# Altium project LMD18200直流电机驱动器.PrjPCB
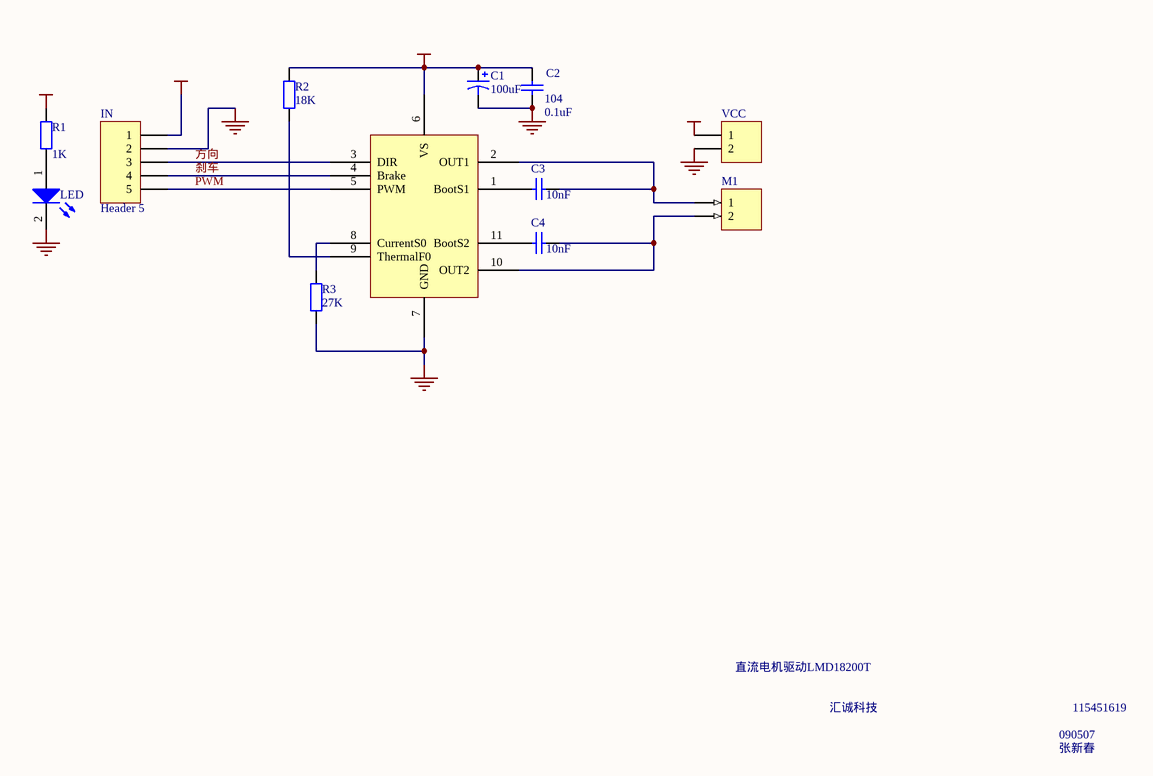
[diagram p0: LMD18200直流电机驱动器.SchDoc]
1 sheet, 12 parts. Net scope: global (net labels, ports and power ports of the same name join across sheets).
Board file: LMD18200直流电机驱动器.PcbDoc

## Sheet LMD18200直流电机驱动器.SchDoc
size A4

### Parts
C1  value 100uF  [C-DJ-6]
C2  104  value 0.1uF  [CPDR]
C3  value 10nF  [CPDR]  (hidden comment: 104)
C4  value 10nF  [CPDR]  (hidden comment: 104)
DS1  LED  [LED_D]
IN  Header 5  [HDR1X5]
M1  (no value)  [JK128_2]
R1  value 1K  [RSE]  (hidden comment: Res)
R2  value 18K  [RSE]
R3  value 27K  [RSE]
VCC  (no value)  [JK128_2]
  (no value)  [LMD18200]

### Nets
+5V: IN.1 R1.2
GND: C1.2 C2.1 DS1.2(K) IN.2 R3.1 VCC.2 .7(GND)
VCC: C1.1 C2.2 R2.2 VCC.1 .6(VS)
PWM: IN.5 .5(PWM)
刹车: IN.4 .4(Brake)
方向: IN.3 .3(DIR)
NetC3_1: C3.1 M1.1 .2(OUT1)
NetC3_2: C3.2 .1(BootS1)
NetC4_1: C4.1 M1.2 .10(OUT2)
NetC4_2: C4.2 .11(BootS2)
NetDS1_1: DS1.1(A) R1.1
NetR2_1: R2.1 .9(ThermalF0)
NetR3_2: R3.2 .8(CurrentS0)

### Notes on the sheet
- 直流电机驱动LMD18200T
- 汇诚科技
- 090507
- 115451619
- 张新春

### Library data of the parts
C1 = Cap Pol3: Polarized Capacitor (Surface Mount); Published: 8-Jun-2000; LatestRevisionDate: 17-Jul-2002; LatestRevisionNote: Re-released for DXP Platform.; PackageReference: C0805; Publisher: Altium Limited
C2-C4 = Cap: Capacitor; Published: 8-Jun-2000; LatestRevisionDate: 17-Jul-2002; LatestRevisionNote: Re-released for DXP Platform.; Publisher: Altium Limited
DS1 = LED: 发光二极管; Published: 8-Jun-2000; LatestRevisionDate: 17-Jul-2002; LatestRevisionNote: Re-released for DXP Platform.; Publisher: Altium Limited
IN = Header 5: Header, 5-Pin; LatestRevisionDate: 17-Jul-2002; LatestRevisionNote: Re-released for DXP Platform.; Publisher: Altium Limited
M1 VCC = MHDR1X2: Header, 2-Pin; LatestRevisionDate: 17-Jul-2002; LatestRevisionNote: Re-released for DXP Platform.; Publisher: Altium Limited
R1 = Res: 电阻; Published: 8-Jun-2000; LatestRevisionDate: 17-Jul-2002; LatestRevisionNote: Re-released for DXP Platform.; Publisher: Altium Limited
R2 R3 = Res2: Resistor; Published: 8-Jun-2000; LatestRevisionDate: 17-Jul-2002; LatestRevisionNote: Re-released for DXP Platform.; Publisher: Altium Limited
 = LMD18200